# Altium schematic sheet LDO_All.SchDoc
size B
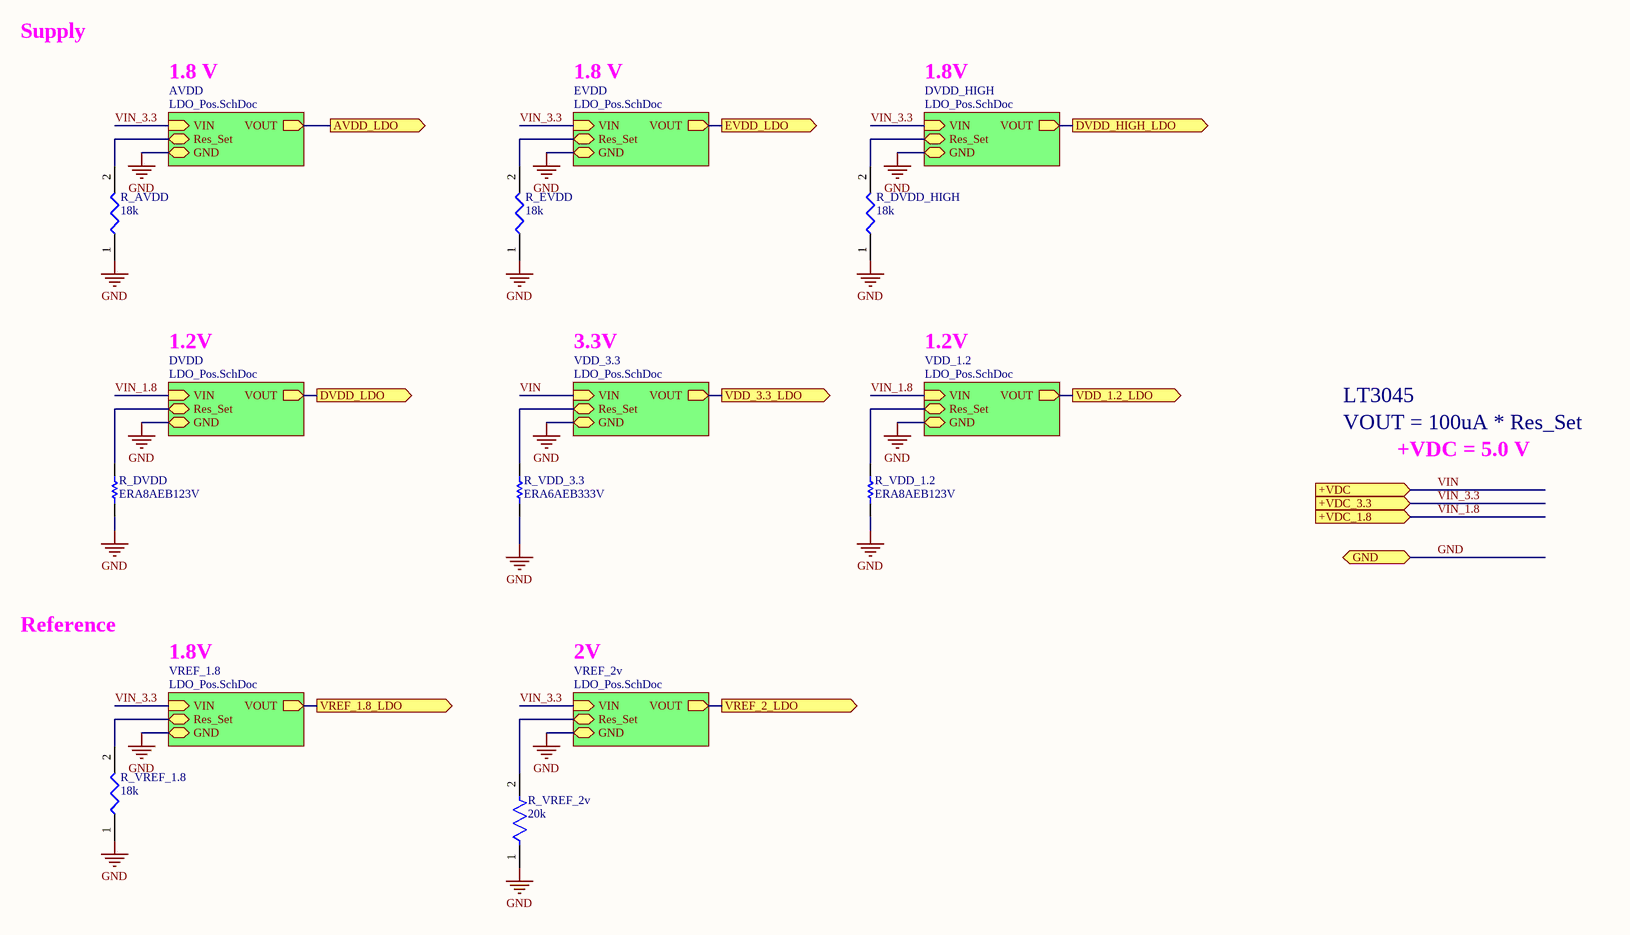
[diagram p0: LDO_All.SchDoc]

## Parts
R_AVDD  18k  [ERA3KV_(0603)]
R_DVDD  ERA8AEB123V  [RESC3216X70X50NL20T25]
R_DVDD_HIGH  18k  [ERA3KV_(0603)]
R_EVDD  18k  [ERA3KV_(0603)]
R_VDD_1.2  ERA8AEB123V  [RESC3216X70X50NL20T25]
R_VDD_3.3  ERA6AEB333V  [RESC2013X60X40NL20T25]
R_VREF_1.8  18k  [ERA3KV_(0603)]
R_VREF_2v  20k  [FP-RT0603-MFG]

## Sub-sheets
AVDD = LDO_Pos.SchDoc: VOUT (out), VIN (in), Res_Set (bidir), GND (bidir)
DVDD = LDO_Pos.SchDoc: VOUT (out), VIN (in), Res_Set (bidir), GND (bidir)
DVDD_HIGH = LDO_Pos.SchDoc: VOUT (out), VIN (in), Res_Set (bidir), GND (bidir)
EVDD = LDO_Pos.SchDoc: VOUT (out), VIN (in), Res_Set (bidir), GND (bidir)
VDD_1.2 = LDO_Pos.SchDoc: VOUT (out), VIN (in), Res_Set (bidir), GND (bidir)
VDD_3.3 = LDO_Pos.SchDoc: VOUT (out), VIN (in), Res_Set (bidir), GND (bidir)
VREF_1.8 = LDO_Pos.SchDoc: VOUT (out), VIN (in), Res_Set (bidir), GND (bidir)
VREF_2v = LDO_Pos.SchDoc: VOUT (out), VIN (in), Res_Set (bidir), GND (bidir)

## Ports
+VDC (in), +VDC_1.8 (in), +VDC_3.3 (in), AVDD_LDO (out), DVDD_HIGH_LDO (out), DVDD_LDO (out), EVDD_LDO (out), GND (bidir), VDD_1.2_LDO (out), VDD_3.3_LDO (out), VREF_1.8_LDO (out), VREF_2_LDO (out)

## Nets
GND: R_AVDD.1 R_DVDD.1 R_DVDD_HIGH.1 R_EVDD.1 R_VDD_1.2.1 R_VDD_3.3.1 R_VREF_1.8.1 R_VREF_2v.1 ; port GND, sheet AVDD/GND, sheet DVDD_HIGH/GND, sheet EVDD/GND, sheet DVDD/GND, sheet VDD_3.3/GND, sheet VREF_2v/GND, sheet VREF_1.8/GND, sheet VDD_1.2/GND
AVDD_LDO: port AVDD_LDO, sheet AVDD/VOUT
DVDD_HIGH_LDO: port DVDD_HIGH_LDO, sheet DVDD_HIGH/VOUT
DVDD_LDO: port DVDD_LDO, sheet DVDD/VOUT
EVDD_LDO: port EVDD_LDO, sheet EVDD/VOUT
VDD_1.2_LDO: port VDD_1.2_LDO, sheet VDD_1.2/VOUT
VDD_3.3_LDO: port VDD_3.3_LDO, sheet VDD_3.3/VOUT
VIN: port +VDC, sheet VDD_3.3/VIN
VIN_1.8: port +VDC_1.8, sheet DVDD/VIN, sheet VDD_1.2/VIN
VIN_3.3: port +VDC_3.3, sheet AVDD/VIN, sheet DVDD_HIGH/VIN, sheet EVDD/VIN, sheet VREF_2v/VIN, sheet VREF_1.8/VIN
VREF_1.8_LDO: port VREF_1.8_LDO, sheet VREF_1.8/VOUT
VREF_2_LDO: port VREF_2_LDO, sheet VREF_2v/VOUT
NetR_AVDD_2: R_AVDD.2 ; sheet AVDD/Res_Set
NetR_DVDD_2: R_DVDD.2 ; sheet DVDD/Res_Set
NetR_DVDD_HIGH_2: R_DVDD_HIGH.2 ; sheet DVDD_HIGH/Res_Set
NetR_EVDD_2: R_EVDD.2 ; sheet EVDD/Res_Set
NetR_VDD_1.2_2: R_VDD_1.2.2 ; sheet VDD_1.2/Res_Set
NetR_VDD_3.3_2: R_VDD_3.3.2 ; sheet VDD_3.3/Res_Set
NetR_VREF_1.8_2: R_VREF_1.8.2 ; sheet VREF_1.8/Res_Set
NetR_VREF_2v_2: R_VREF_2v.2 ; sheet VREF_2v/Res_Set

## Notes on the sheet
- Supply
- 1.8 V
- 1.8V
- 1.2V
- 3.3V
- VOUT = 100uA * Res_Set
- LT3045
- +VDC = 5.0 V
- Reference
- 2V

## Library data of the parts
R_AVDD R_DVDD_HIGH R_EVDD R_VREF_1.8 = Res 18k 0.05% 0603: Resistor; Manufacturer_Name: Panasonic; Manufacturer_Part_Number: ERA-3VRW1802V; Datasheet Link: http://industrial.panasonic.com/cdbs/www-data/pdf/RDM0000/RDM0000C331.pdf; Height: 0.4mm; Supplier 1: Digi-Key; Supplier Part Number 1: 10-ERA-3VRW1802VCT-ND
R_DVDD R_VDD_1.2 = CMP-2003-04416-1: Manufacturer: Panasonic; Part Number: ERA8AEB123V
R_VDD_3.3 = CMP-2001-00630-1: Manufacturer: Panasonic; Part Number: ERA6AEB333V
R_VREF_2v = CMP-03412-016182-1: RES SMD 20K OHM 0.1% 1/10W 0603; Manufacturer: Yageo; Manufacturer Part Number: RT0603BRE0720KL; Power Rating: 0.1W; Resistance: 20KΩ; Value: 20KΩ; Tolerance: 0.001; Voltage Rating: 75V; Temperature Coefficient: 50 ppm/°C; Category: Res; Height: 0.55mm; Ipc Land Pattern Name: RESC16080X45; RoHS: TRUE; Device Class L3: Chip SMD Resistors; Composition: Thin Film; Lead Free: Yes; Octopart: https://octopart.com/rt0603bre0720kl-yageo-1390266; Temperature: -55°C to +155°C; Series: RT; Digikey Description: RES SMD 20K OHM 0.1% 1/10W 0603; Footprint Url: http://www.yageo.com/exep/pages/download/literatures/PYu-R_Mount_10.pdf; Temperature Range Low: -55°C; Package: RT0603; Device Class L2: Resistors; ComponentLink2URL: http://www.yageo.com/documents/recent/PYu-RT_1-to-0.01_RoHS_L_9.pdf; ComponentLink2Description: Datasheet; Device Class L1: Passive Components; Temperature Range High: +155°C; Automotive: No